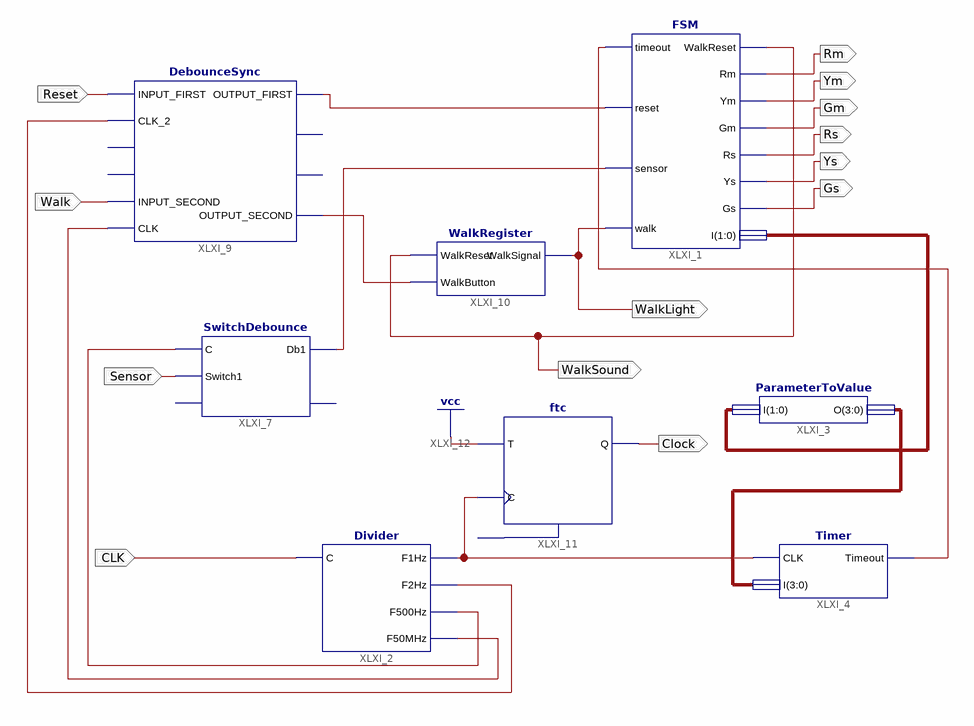
[diagram p0: schematic sheet 1]
// Xilinx ISE schematic TrafficLight.sch (spartan6) as structural Verilog: 8 symbols, 13 ports
module TrafficLight (
  input  CLK,
  input  Reset,
  input  Walk,
  input  Sensor,
  output WalkSound,
  output WalkLight,
  output Rm,
  output Ym,
  output Gm,
  output Rs,
  output Ys,
  output Gs,
  output Clock
);

  wire XLXN_3, XLXN_25, XLXN_35, XLXN_36, XLXN_37, XLXN_70, XLXN_75, XLXN_77;
  wire [1:0] XLXN_1;
  wire [3:0] XLXN_2;

  Divider XLXI_2 (.C(CLK), .F1Hz(XLXN_3), .F2Hz(XLXN_36), .F500Hz(XLXN_37), .F50MHz(XLXN_35));
  ParameterToValue XLXI_3 (.I(XLXN_1), .O(XLXN_2));
  Timer XLXI_4 (.CLK(XLXN_3), .I(XLXN_2), .Timeout(XLXN_77));
  SwitchDebounce XLXI_7 (.C(XLXN_37), .Switch1(Sensor), .Db1(XLXN_75));  // open: Switch2, Db2
  DebounceSync XLXI_9 (
    .INPUT_FIRST(Reset), .CLK_2(XLXN_36), .INPUT_SECOND(Walk), .CLK(XLXN_35), .OUTPUT_FIRST(XLXN_25),
    .OUTPUT_SECOND(XLXN_70));  // open: INPUT_FOURTH, INPUT_THIRD, OUTPUT_FOURTH, OUTPUT_THIRD
  FSM XLXI_1 (
    .timeout(XLXN_77), .reset(XLXN_25), .sensor(XLXN_75), .walk(WalkLight), .WalkReset(WalkSound), .Rm(Rm),
    .Ym(Ym), .Gm(Gm), .Rs(Rs), .Ys(Ys), .Gs(Gs), .I(XLXN_1));
  WalkRegister XLXI_10 (.WalkReset(WalkSound), .WalkButton(XLXN_70), .WalkSignal(WalkLight));
  ftc XLXI_11 (.C(XLXN_3), .T(1'b1), .Q(Clock));  // open: CLR

  // Notes on the sheet:
  //   LOC on signal CLK = V10
  //   LOC on signal Reset = C4
  //   LOC on signal Walk = D9
  //   LOC on signal Sensor = T10
  //   LOC on signal WalkSound = T12
  //   LOC on signal WalkLight = U16
  //   LOC on signal Rm = T11
  //   LOC on signal Ym = R11
  //   LOC on signal Gm = N11
  //   LOC on signal Rs = M11
  //   LOC on signal Ys = V15
  //   LOC on signal Gs = U15
  //   LOC on signal Clock = V16
endmodule
